# EAGLE schematic writer (EAGLE 6.6.0)
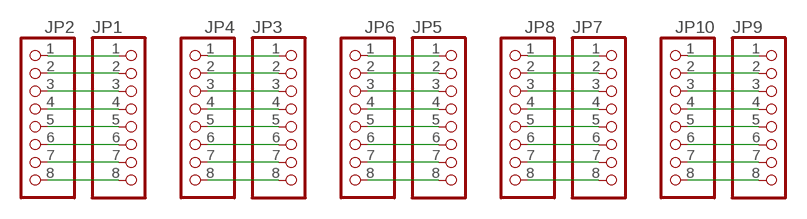
[diagram p0: schematic, sheet 1]

## Parts
JP1  PINHD-1X8  [1X08]
JP2  PINHD-1X8  [1X08]
JP3  PINHD-1X8  [1X08]
JP4  PINHD-1X8  [1X08]
JP5  PINHD-1X8  [1X08]
JP6  PINHD-1X8  [1X08]
JP7  PINHD-1X8  [1X08]
JP8  PINHD-1X8  [1X08]
JP9  PINHD-1X8  [1X08]
JP10  PINHD-1X8  [1X08]

## Nets
N$1: JP1.1 JP2.1
N$2: JP1.2 JP2.2
N$3: JP1.3 JP2.3
N$4: JP1.4 JP2.4
N$5: JP1.5 JP2.5
N$6: JP1.6 JP2.6
N$7: JP1.7 JP2.7
N$8: JP1.8 JP2.8
N$9: JP3.1 JP4.1
N$10: JP3.2 JP4.2
N$11: JP3.3 JP4.3
N$12: JP3.4 JP4.4
N$13: JP3.5 JP4.5
N$14: JP3.6 JP4.6
N$15: JP3.7 JP4.7
N$16: JP3.8 JP4.8
N$17: JP5.1 JP6.1
N$18: JP5.2 JP6.2
N$19: JP5.3 JP6.3
N$20: JP5.4 JP6.4
N$21: JP5.5 JP6.5
N$22: JP5.6 JP6.6
N$23: JP5.7 JP6.7
N$24: JP5.8 JP6.8
N$25: JP7.1 JP8.1
N$26: JP7.2 JP8.2
N$27: JP7.3 JP8.3
N$28: JP7.4 JP8.4
N$29: JP7.5 JP8.5
N$30: JP7.6 JP8.6
N$31: JP7.7 JP8.7
N$32: JP7.8 JP8.8
N$33: JP9.1 JP10.1
N$34: JP9.2 JP10.2
N$35: JP9.3 JP10.3
N$36: JP9.4 JP10.4
N$37: JP9.5 JP10.5
N$38: JP9.6 JP10.6
N$39: JP9.7 JP10.7
N$40: JP9.8 JP10.8

## Library data of the parts
JP1-JP10 = pinhead:PINHD-1X8: PIN HEADER